# EAGLE schematic bn5_redraw (EAGLE 8.5.1)
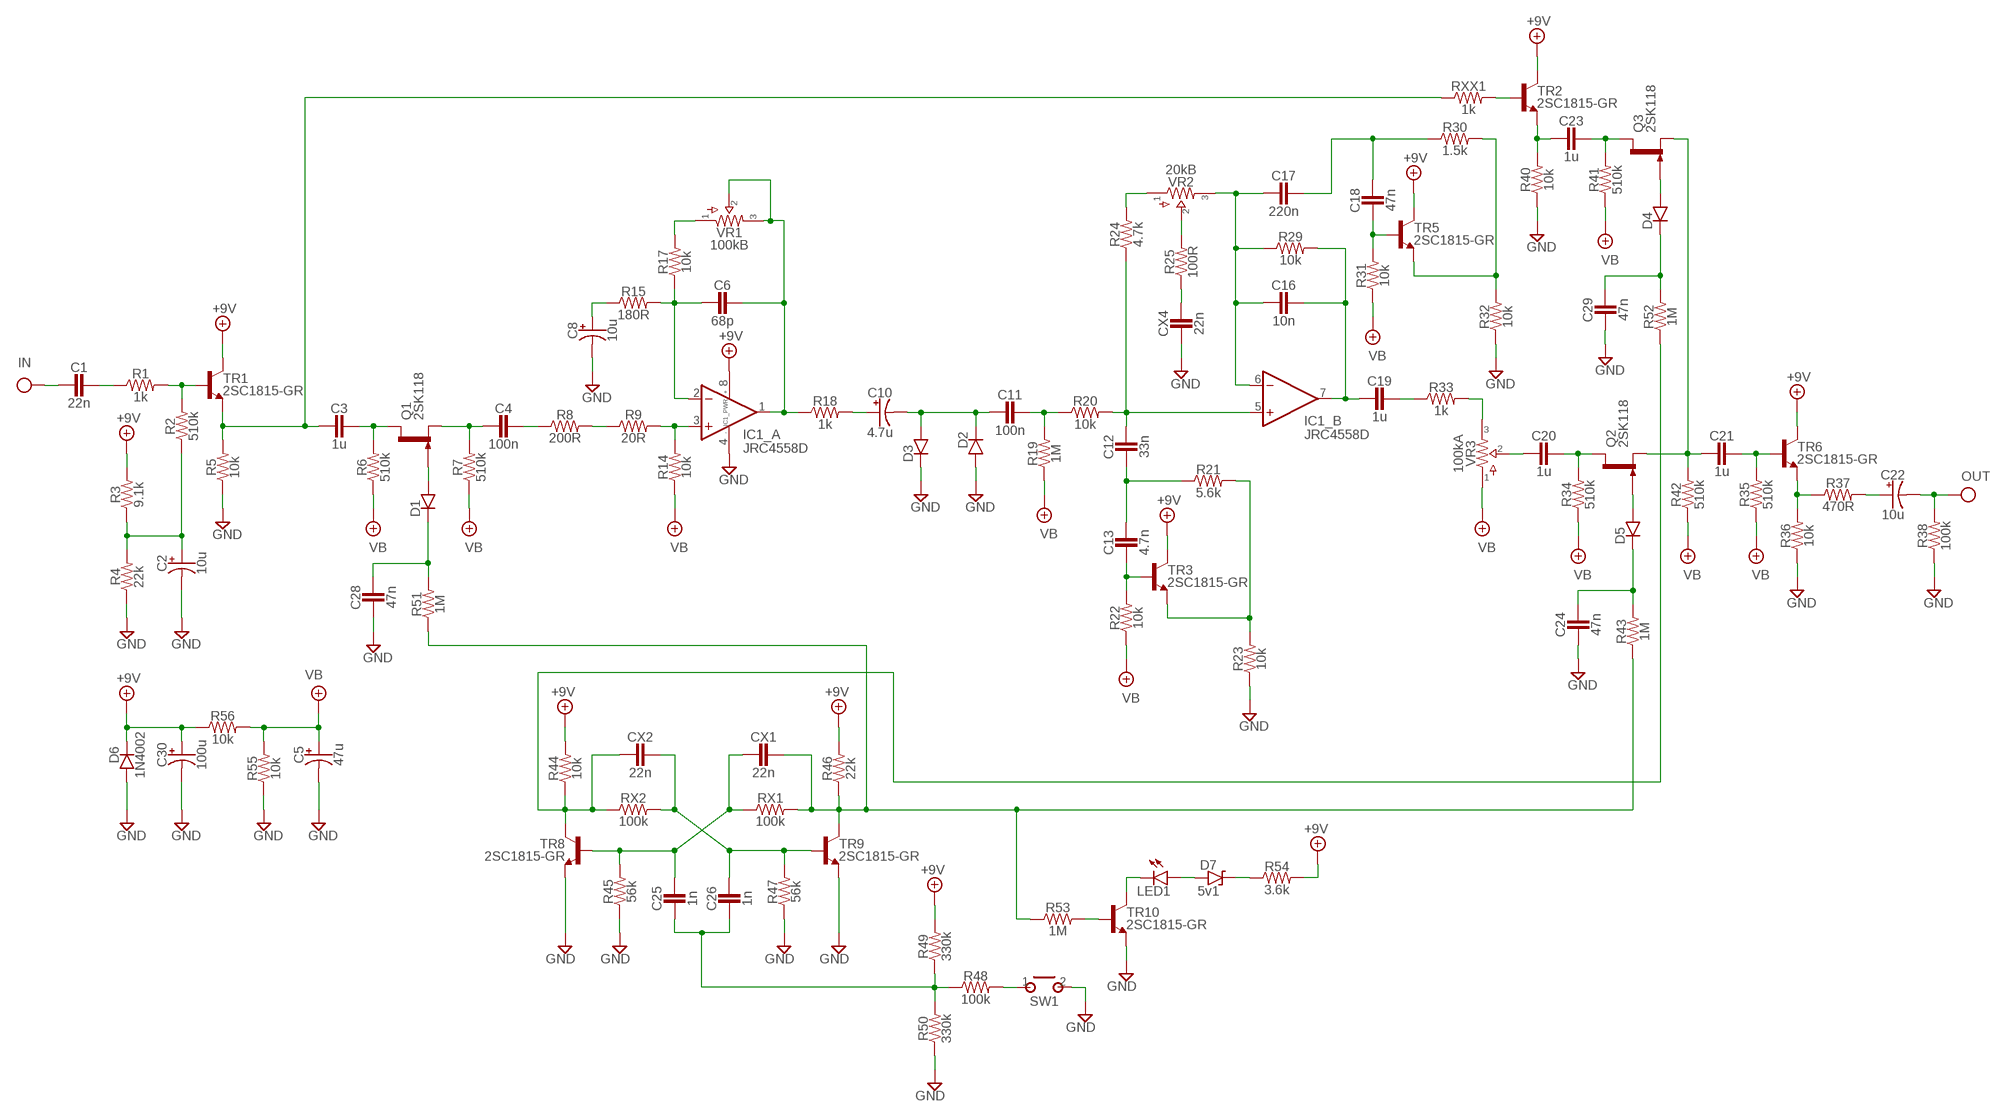
[diagram p0: schematic, sheet 1]

## Parts
C1  22n  CER/FILMBOX.1  [BOX_SMALL]
C2  10u  0500  [050_020]
C3  1u  CER/FILMBOX.1  [BOX_SMALL]
C4  100n  CER/FILMBOX.1  [BOX_SMALL]
C5  47u  0500  [050_020]
C6  68p  CER/FILMBOX.1  [BOX_SMALL]
C8  10u  0500  [050_020]
C10  4.7u  0500  [050_020]
C11  100n  CER/FILMBOX.1  [BOX_SMALL]
C12  33n  CER/FILMBOX.1  [BOX_SMALL]
C13  4.7n  CER/FILMBOX.1  [BOX_SMALL]
C16  10n  CER/FILMBOX.1  [BOX_SMALL]
C17  220n  CER/FILMBOX.1  [BOX_SMALL]
C18  47n  CER/FILMBOX.1  [BOX_SMALL]
C19  1u  CER/FILMBOX.1  [BOX_SMALL]
C20  1u  CER/FILMBOX.1  [BOX_SMALL]
C21  1u  CER/FILMBOX.1  [BOX_SMALL]
C22  10u  0500  [050_020]
C23  1u  CER/FILMBOX.1  [BOX_SMALL]
C24  47n  CER/FILMBOX.1  [BOX_SMALL]
C25  1n  CER/FILMBOX.1  [BOX_SMALL]
C26  1n  CER/FILMBOX.1  [BOX_SMALL]
C28  47n  CER/FILMBOX.1  [BOX_SMALL]
C29  47n  CER/FILMBOX.1  [BOX_SMALL]
C30  100u  0500  [050_020]
CX1  22n  CER/FILMBOX.1  [BOX_SMALL]
CX2  22n  CER/FILMBOX.1  [BOX_SMALL]
CX4  22n  CER/FILMBOX.1  [BOX_SMALL]
D1  DO35.2  [DO35-2]
D2  DO35.2  [DO35-2]
D3  DO35.2  [DO35-2]
D4  DO35.2  [DO35-2]
D5  DO35.2  [DO35-2]
D6  1N4002  DO35.2  [DO35-2]
D7  5v1  ZENER.2  [DO41-2]
IC1  JRC4558D  DUALTH  [DIL0]
LED1  LED  [3MM_D]
Q1  2SK118  2N5457  [TO92-]
Q2  2SK118  2N5457  [TO92-]
Q3  2SK118  2N5457  [TO92-]
R1  1k  R_.3B  [R0207/3]
R2  510k  R_.3B  [R0207/3]
R3  9.1k  R_.3B  [R0207/3]
R4  22k  R_.3B  [R0207/3]
R5  10k  R_.3B  [R0207/3]
R6  510k  R_.3B  [R0207/3]
R7  510k  R_.3B  [R0207/3]
R8  200R  R_.3B  [R0207/3]
R9  20R  R_.3B  [R0207/3]
R14  10k  R_.3B  [R0207/3]
R15  180R  R_.3B  [R0207/3]
R17  10k  R_.3B  [R0207/3]
R18  1k  R_.3B  [R0207/3]
R19  1M  R_.3B  [R0207/3]
R20  10k  R_.3B  [R0207/3]
R21  5.6k  R_.3B  [R0207/3]
R22  10k  R_.3B  [R0207/3]
R23  10k  R_.3B  [R0207/3]
R24  4.7k  R_.3B  [R0207/3]
R25  100R  R_.3B  [R0207/3]
R29  10k  R_.3B  [R0207/3]
R30  1.5k  R_.3B  [R0207/3]
R31  10k  R_.3B  [R0207/3]
R32  10k  R_.3B  [R0207/3]
R33  1k  R_.3B  [R0207/3]
R34  510k  R_.3B  [R0207/3]
R35  510k  R_.3B  [R0207/3]
R36  10k  R_.3B  [R0207/3]
R37  470R  R_.3B  [R0207/3]
R38  100k  R_.3B  [R0207/3]
R40  10k  R_.3B  [R0207/3]
R41  510k  R_.3B  [R0207/3]
R42  510k  R_.3B  [R0207/3]
R43  1M  R_.3B  [R0207/3]
R44  10k  R_.3B  [R0207/3]
R45  56k  R_.3B  [R0207/3]
R46  22k  R_.3B  [R0207/3]
R47  56k  R_.3B  [R0207/3]
R48  100k  R_.3B  [R0207/3]
R49  330k  R_.3B  [R0207/3]
R50  330k  R_.3B  [R0207/3]
R51  1M  R_.3B  [R0207/3]
R52  1M  R_.3B  [R0207/3]
R53  1M  R_.3B  [R0207/3]
R54  3.6k  R_.3B  [R0207/3]
R55  10k  R_.3B  [R0207/3]
R56  10k  R_.3B  [R0207/3]
RX1  100k  R_.3B  [R0207/3]
RX2  100k  R_.3B  [R0207/3]
RXX1  1k  R_.3B  [R0207/3]
SW1  MOMENTARY  [SPST]
TR1  2SC1815-GR  2SC828A  [TO92-]
TR2  2SC1815-GR  2SC828A  [TO92-]
TR3  2SC1815-GR  2SC828A  [TO92-]
TR5  2SC1815-GR  2SC828A  [TO92-]
TR6  2SC1815-GR  2SC828A  [TO92-]
TR8  2SC1815-GR  2SC828A  [TO92-]
TR9  2SC1815-GR  2SC828A  [TO92-]
TR10  2SC1815-GR  2SC828A  [TO92-]
VR1  100kB  POTS16MM  [16MM]
VR2  20kB  POTS16MM  [16MM]
VR3  100kA  POTS16MM  [16MM]

## Nets
+9V: C30.+ D6.C IC1.8(_PWR:V+) R3.2 R44.2 R46.2 R49.2 R54.2 R56.1 TR1.2(C) TR2.2(C) TR3.2(C) TR5.2(C) TR6.2(C)
GND: C2.- C5.- C8.- C24.2 C28.2 C29.2 C30.- CX4.2 D2.A D3.C D6.A IC1.4(_PWR:V-) R4.1 R5.1 R23.1 R32.1 R36.1 R38.1 R40.1 R45.1 R47.1 R50.1 R55.1 SW1.2(S) TR8.3(E) TR9.3(E) TR10.3(E)
IN: C1.2
N$1: C2.+ R2.1 R3.1 R4.2
N$2: C3.1 Q1.3(D) R6.2
N$3: R1.2 R2.2 TR1.1(B)
N$4: D1.A Q1.1(G)
N$5: C1.1 R1.1
N$6: C3.2 R5.2 RXX1.1 TR1.3(E)
N$7: C4.2 Q1.2(S) R7.2
N$8: C4.1 R8.1
N$9: R8.2 R9.1
N$10: IC1.3(_A:+IN) R9.2 R14.2
N$11: C6.2 IC1.2(_A:-IN) R15.2 R17.1
N$12: C6.1 IC1.1(_A:OUT) R18.1 VR1.2 VR1.3
N$13: R17.2 VR1.1
N$14: C10.+ R18.2
N$15: C8.+ R15.1
N$16: C10.- C11.2 D2.C D3.A
N$17: C11.1 R19.2 R20.1
N$18: C12.1 IC1.5(_B:+IN) R20.2 R24.1
N$19: C12.2 C13.1 R21.1
N$20: R21.2 R23.2 TR3.3(E)
N$21: R24.2 VR2.1
N$22: C13.2 R22.2 TR3.1(B)
N$23: R25.2 VR2.2
N$24: CX4.1 R25.1
N$25: C16.2 C17.2 IC1.6(_B:-IN) R29.1 VR2.3
N$26: C25.2 C26.2 R48.1 R49.1 R50.2
N$27: C17.1 C18.1 R30.1
N$28: R30.2 R32.2 TR5.3(E)
N$29: D7.C R54.1
N$30: C18.2 R31.2 TR5.1(B)
N$31: CX2.2 R44.1 R52.1 RX2.1 TR8.2(C)
N$32: C26.1 CX2.1 R47.2 RX2.2 TR9.1(B)
N$33: C16.1 C19.2 IC1.7(_B:OUT) R29.2
N$34: C25.1 CX1.2 R45.2 RX1.1 TR8.1(B)
N$35: R48.2 SW1.1(P)
N$36: C19.1 R33.1
N$37: R33.2 VR3.3
N$38: C20.2 VR3.2
N$39: C20.1 Q2.3(D) R34.2
N$40: D5.A Q2.1(G)
N$41: C21.2 Q2.2(S) Q3.2(S) R42.2
N$42: C24.1 D5.C R43.2
N$43: RXX1.2 TR2.1(B)
N$44: C23.2 R40.2 TR2.3(E)
N$45: C23.1 Q3.3(D) R41.2
N$46: D4.A Q3.1(G)
N$47: C29.1 D4.C R52.2
N$48: C21.1 R35.2 TR6.1(B)
N$49: R36.2 R37.1 TR6.3(E)
N$50: C22.+ R37.2
N$51: C28.1 D1.C R51.2
N$52: D7.A LED1.ANODE(A)
N$53: CX1.1 R43.1 R46.1 R51.1 R53.1 RX1.2 TR9.2(C)
N$54: LED1.P$1(C) TR10.2(C)
N$55: R53.2 TR10.1(B)
OUT: C22.- R38.2
VB: C5.+ R6.1 R7.1 R14.1 R19.1 R22.1 R31.1 R34.1 R35.1 R41.1 R42.1 R55.2 R56.2 VR3.1

## Library data of the parts
C1 C3 C4 C6 C11-C13 C16-C21 C23-C26 C28 C29 CX1 CX2 CX4 = pedals-capacitors-film:CER/FILM: 47 - 120pF Xicon Ceramic Disc 2.5mm lead spacing
C2 C5 C8 C10 C22 C30 = pedals-capacitors-elec:050
D1-D6 = pedals-diodes:DO35: DO-35 Package Diodes: 1N914
D7 = pedals-diodes:ZENER
IC1 = pedals-integrated circuits:DUAL: OP AMP
LED1 = pedals-diodes:LED
Q1-Q3 = pedals-transistors:2N5457: N-CHANNEL JFET
R1-R9 R14 R15 R17-R25 R29-R38 R40-R56 RX1 RX2 RXX1 = pedals-resistors:R_
SW1 = pedals-switches:MOMENTARY
TR1-TR3 TR5 TR6 TR8-TR10 = pedals-transistors:2SC828A
VR1-VR3 = pedals-potentiometers:POTS